# Altium schematic sheet ArbPwrBoost_P4.SchDoc: =ProjectTitle
size B; Engineer: Hab Collector; Organization: Altium Limited; Address1: 3621 Gin Way; Address2: Snellville, GA 30039; SheetNumber: 4; SheetTotal: 7
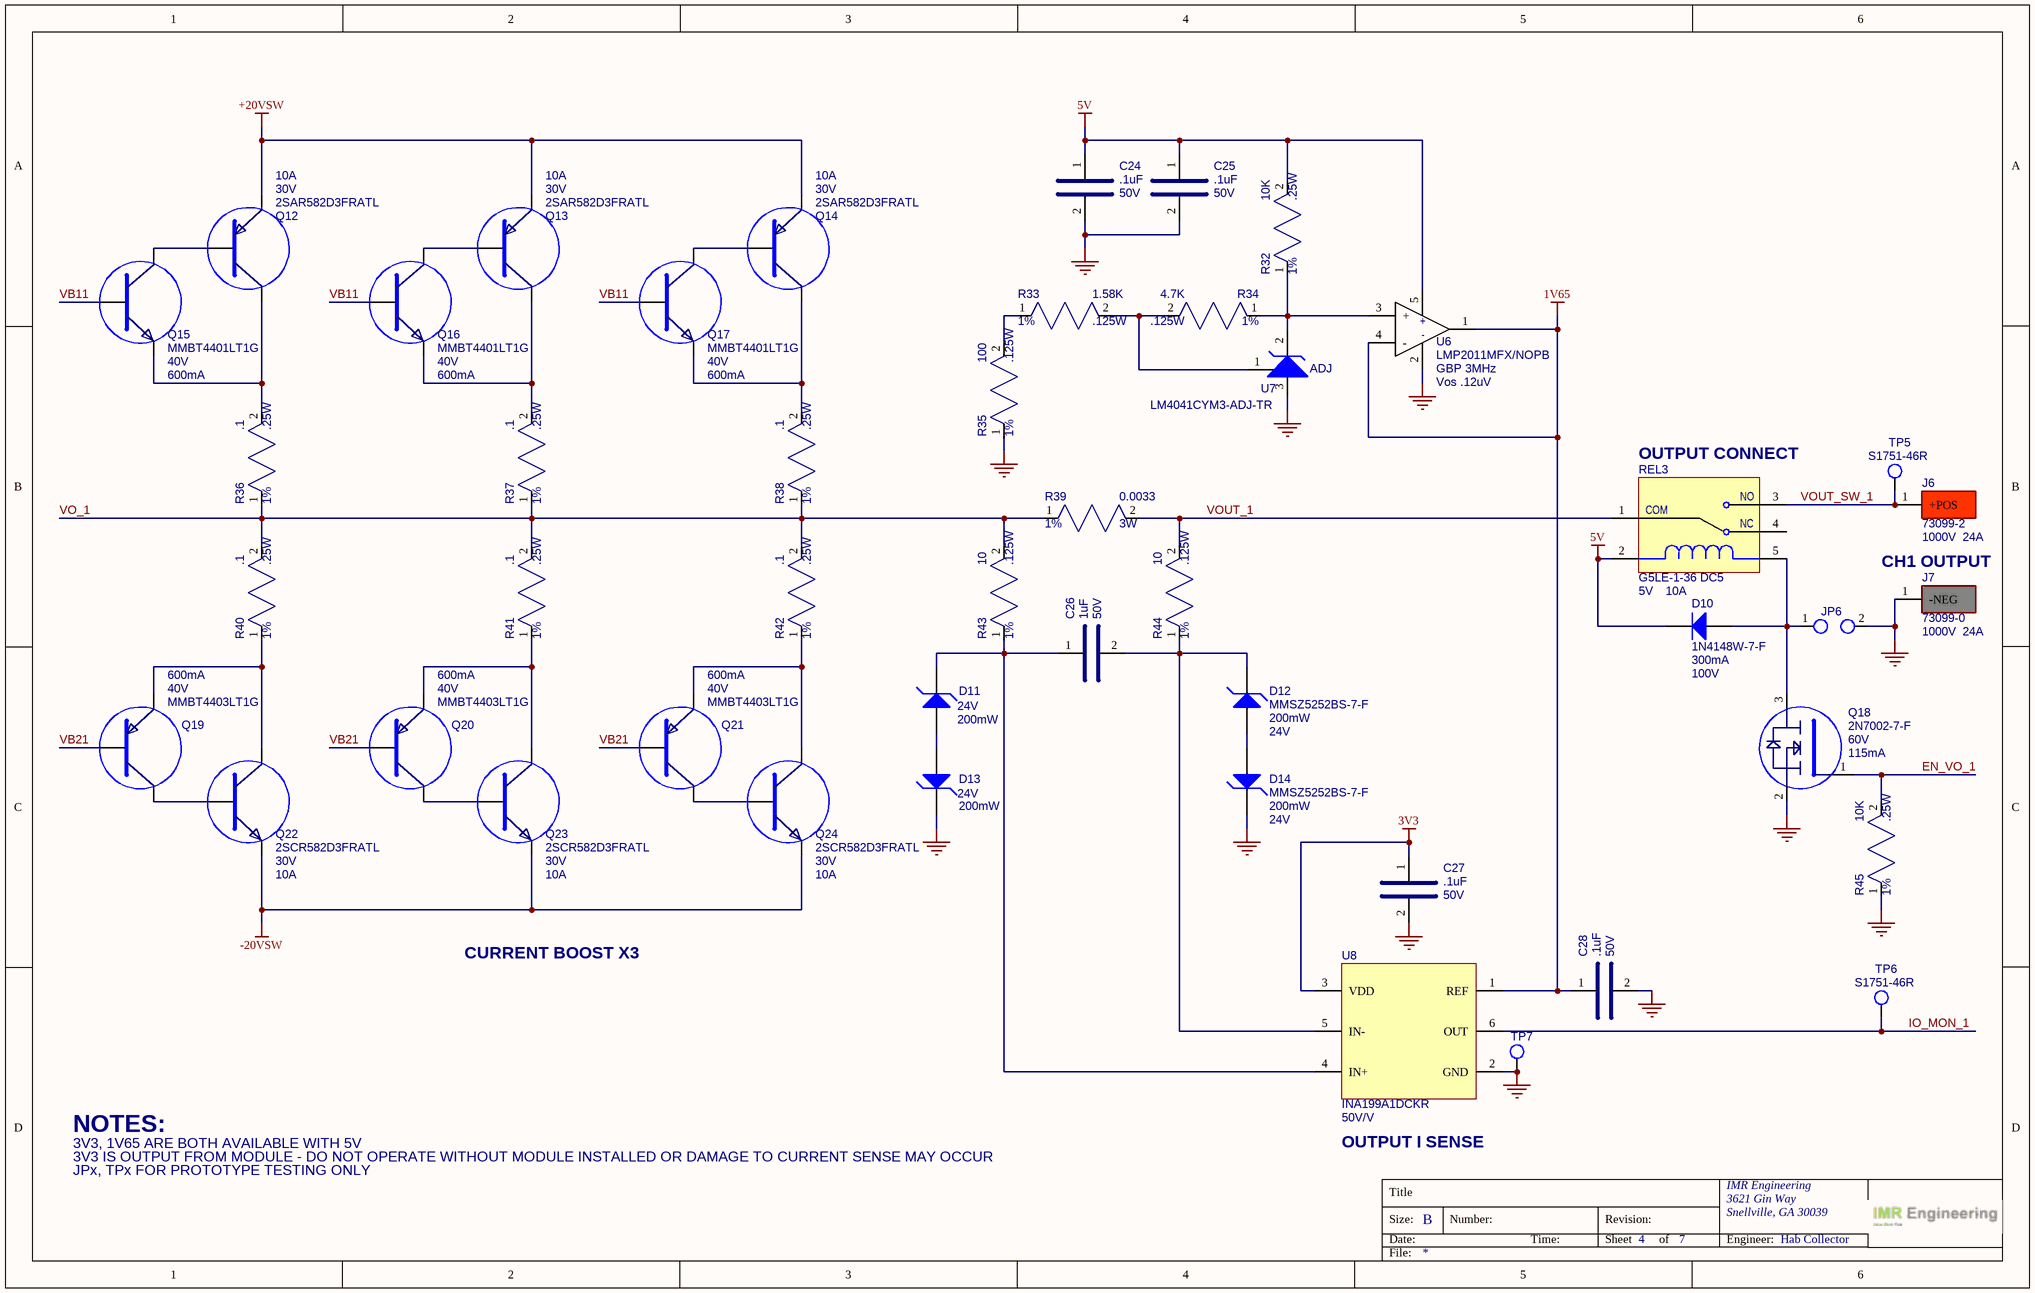
[diagram p0: ArbPwrBoost_P4.SchDoc]

## Parts
C24  value .1uF  Voltage: 50V  [CAP_0805]  (hidden comment: KGM21NR71H104KT)
C25  value .1uF  Voltage: 50V  [CAP_0805]  (hidden comment: KGM21NR71H104KT)
C26  value 1uF  Voltage: 50V  [CAP_0805]  (hidden comment: 08055C105K4T2A)
C27  value .1uF  Voltage: 50V  [CAP_0805]  (hidden comment: KGM21NR71H104KT)
C28  value .1uF  Voltage: 50V  [CAP_0805]  (hidden comment: KGM21NR71H104KT)
D10  value 100V  Current: 300mA  [SOD123]  (hidden comment: 1N4148W-7-F)
D11  value 24V  Power: 200mW  [SOD323]  (hidden comment: MMSZ5252BS-7-F)
D12  value 24V  Power: 200mW  [SOD323]  (hidden comment: MMSZ5252BS-7-F)
D13  value 24V  Power: 200mW  [SOD323]  (hidden comment: MMSZ5252BS-7-F)
D14  value 24V  Power: 200mW  [SOD323]  (hidden comment: MMSZ5252BS-7-F)
J6  value 1000V  Current: 24A  [Pomona_73099-2]  (hidden comment: 73099-2)
J7  value 1000V  Current: 24A  [Pomona_73099-0]  (hidden comment: 73099-0)
JP6  PREC002SFAN-RC  [HDR_1X2_100MILL]  (value not drawn)
Q12  value 30V  Current: 10A  [TO-252]  (hidden comment: 2SAR582D3FRATL)
Q13  value 30V  Current: 10A  [TO-252]  (hidden comment: 2SAR582D3FRATL)
Q14  value 30V  Current: 10A  [TO-252]  (hidden comment: 2SAR582D3FRATL)
Q15  value 40V  Current: 600mA  [SOT-23]  (hidden comment: MMBT4401LT1G)
Q16  value 40V  Current: 600mA  [SOT-23]  (hidden comment: MMBT4401LT1G)
Q17  value 40V  Current: 600mA  [SOT-23]  (hidden comment: MMBT4401LT1G)
Q18  value 60V  Current: 115mA  [SOT-23]  (hidden comment: 2N7002-7-F)
Q19  value 40V  Current: 600mA  [SOT-23]  (hidden comment: MMBT4403LT1G)
Q20  value 40V  Current: 600mA  [SOT-23]  (hidden comment: MMBT4403LT1G)
Q21  value 40V  Current: 600mA  [SOT-23]  (hidden comment: MMBT4403LT1G)
Q22  value 30V  Current: 10A  [TO-252]  (hidden comment: 2SCR582D3FRATL)
Q23  value 30V  Current: 10A  [TO-252]  (hidden comment: 2SCR582D3FRATL)
Q24  value 30V  Current: 10A  [TO-252]  (hidden comment: 2SCR582D3FRATL)
R32  value 10K  Power: .25W  Tolerance: 1%  [RES_0805]  (hidden comment: RC0805FR-7W10KL)
R33  value 1.58K  Power: .125W  Tolerance: 1%  [RES_0805]  (hidden comment: RC0805FR-071K58L)
R34  value 4.7K  Power: .125W  Tolerance: 1%  [RES_0805]  (hidden comment: RC0805FR-134K7L)
R35  value 100  Power: .125W  Tolerance: 1%  [RES_0805]  (hidden comment: RC0805FR-07100RL)
R36  value .1  Power: .25W  Tolerance: 1%  [RES_1206]  (hidden comment: 311-0.1LWCT-ND)
R37  value .1  Power: .25W  Tolerance: 1%  [RES_1206]  (hidden comment: 311-0.1LWCT-ND)
R38  value .1  Power: .25W  Tolerance: 1%  [RES_1206]  (hidden comment: 311-0.1LWCT-ND)
R39  value 0.0033  Tolerance: 1%  Power: 3W  [RES_2512]  (hidden comment: WSLP25123L300FEA)
R40  value .1  Power: .25W  Tolerance: 1%  [RES_1206]  (hidden comment: 311-0.1LWCT-ND)
R41  value .1  Power: .25W  Tolerance: 1%  [RES_1206]  (hidden comment: 311-0.1LWCT-ND)
R42  value .1  Power: .25W  Tolerance: 1%  [RES_1206]  (hidden comment: 311-0.1LWCT-ND)
R43  value 10  Power: .125W  Tolerance: 1%  [RES_0805]  (hidden comment: RC0805FR-1310RL)
R44  value 10  Power: .125W  Tolerance: 1%  [RES_0805]  (hidden comment: RC0805FR-1310RL)
R45  value 10K  Power: .25W  Tolerance: 1%  [RES_0805]  (hidden comment: RC0805FR-7W10KL)
REL3  value 5V  Current: 10A  [G5LE]  (hidden comment: G5LE-1-36 DC5)
TP5  S1751-46R  [HARWIN_S1751]
TP6  S1751-46R  [HARWIN_S1751]
TP7  (no value)  [TEST_POINT_20MIL_TH]  (no BOM)
U6  value GBP 3MHz  Vos: Vos .12uV  [SOT-23-5]  (hidden comment: LMP2011MFX/NOPB)
U7  value ADJ  [SOT-23]  (hidden comment: LM4041CYM3-ADJ-TR)
U8  value 50V/V  [SC-70-6]  (hidden comment: INA199A1DCKR)

## Nets
1V65: C28.1 U6.1 U6.4(-) U8.1(REF)
3V3: C27.1 U8.3(VDD)
5V: C24.1 C25.1 D10.2(K) R32.2 REL3.2 U6.5
+20VSW: Q12.2(E) Q13.2(E) Q14.2(E)
-20VSW: Q22.2(E) Q23.2(E) Q24.2(E)
GND: C24.2 C25.2 C27.2 C28.2 D13.2(K) D14.2(K) J7.1(-NEG) JP6.2 Q18.2(E) R35.1 R45.1 TP7.1 U6.2 U7.3(A) U8.2(GND)
EN_VO_1: Q18.1(B) R45.2
IO_MON_1: TP6.1 U8.6(OUT)
VB11: Q15.1(B) Q16.1(B) Q17.1(B)
VB21: Q19.1(B) Q20.1(B) Q21.1(B)
VO_1: R36.1 R37.1 R38.1 R39.1 R40.2 R41.2 R42.2 R43.2
VOUT_1: R39.2 R44.2 REL3.1(COM)
VOUT_SW_1: J6.1(+POS) REL3.3(NO) TP5.1
NetC26_1: C26.1 D11.2(K) R43.1 U8.4(IN+)
NetC26_2: C26.2 D12.2(K) R44.1 U8.5(IN-)
NetD10_1: D10.1(A) JP6.1 Q18.3(C) REL3.5
NetD11_1: D11.1(A) D13.1(A)
NetD12_1: D12.1(A) D14.1(A)
NetQ12_1: Q12.1(B) Q15.3(C)
NetQ12_3: Q12.3(C) Q15.2(E) R36.2
NetQ13_1: Q13.1(B) Q16.3(C)
NetQ13_3: Q13.3(C) Q16.2(E) R37.2
NetQ14_1: Q14.1(B) Q17.3(C)
NetQ14_3: Q14.3(C) Q17.2(E) R38.2
NetQ19_2: Q19.2(E) Q22.3(C) R40.1
NetQ19_3: Q19.3(C) Q22.1(B)
NetQ20_2: Q20.2(E) Q23.3(C) R41.1
NetQ20_3: Q20.3(C) Q23.1(B)
NetQ21_2: Q21.2(E) Q24.3(C) R42.1
NetQ21_3: Q21.3(C) Q24.1(B)
NetR32_1: R32.1 R34.1 U6.3(+) U7.2(K)
NetR33_1: R33.1 R35.2
NetR33_2: R33.2 R34.2 U7.1(FB)

Not connected (* = marked no-connect by the designer): REL3 4(NC)

## Notes on the sheet
- (near REL3) OUTPUT CONNECT
- (near J7) CH1 OUTPUT
- CURRENT BOOST X3
- NOTES:
- 3V3, 1V65 ARE BOTH AVAILABLE WITH 5V
- 3V3 IS OUTPUT FROM MODULE - DO NOT OPERATE WITHOUT MODULE INSTALLED OR DAMAGE TO CURRENT SENSE MAY OCCUR
- JPx, TPx FOR PROTOTYPE TESTING ONLY
- OUTPUT I SENSE
- Title
- Size:
- Date:
- B
- Number:
- Time:
- Revision:
- Sheet
- of
- IMR Engineering
- Engineer:
- File:

## Library data of the parts
C24 C25 C27 C28 = CAP_SMD_0.1UF_50V_0805: CAP CER 0.1UF 50V X7R 0805; MFG: KYOCERA AVX; Case/Package: 0805; MFG_PN: KGM21NR71H104KT; Supplier 1: DigiKey; Supplier Part Number 1: 478-KGM21NR71H104KTCT-ND; Unit Price: .1
C26 = CAP_SMD_1UF_50V_0805: CAP CER 1UF 50V X7R 0805; MFG: KYOCERA AVX; Case/Package: 0805; MFG_PN: 08055C105K4T2A; Supplier 1: DigiKey; Supplier Part Number 1: 478-KAM21KR71H105KUCT-ND; Unit Price: .27
D10 = DIODE_1N4148W-7-F: RELAY REED SPDT 250MA 5V; MFG: Diodes Inc; Case/Package: SOD-123; Supplier 1: DigiKey; Supplier Part Number 1: 1N4148W-FDICT-ND; Unit Price: .16; MFG_PN: 1N4148W-7-F
D11-D14 = DIODE_ZENER_MMSZ5252BS-7-F: DIODE ZENER 24V 200MW SOD323; MFG: Diodes Inc; Case/Package: SOD-123; Supplier 1: DigiKey; Supplier Part Number 1: MMSZ5252BS-FDICT-ND; Unit Price: .12; MFG_PN: MMSZ5252BS-7-F
J6 = CONN_PANOMA_73099-2: CONN 4mm Banana Socket Right Angle PCB RED; MFG: Pomona; Case/Package: 73099-2; Supplier 1: DigiKey; Supplier Part Number 1: 501-73099-2-ND; Unit Price: 10.39; MFG_PN: 73099-2
J7 = CONN_PANOMA_73099-0: CONN 4mm Banana Socket Right Angle PCB BLK; MFG: Pomona; Case/Package: 73099-0; Supplier 1: DigiKey; Supplier Part Number 1: 501-73099-0-ND; Unit Price: 10.39; MFG_PN: 73099-0
JP6 = CONN_JUMPER_2P_100MIL_VERT: CONN HEADER VERT 2POS 2.54MM; MFG: Sullins Connector Solutions; Case/Package: 2P_2.54MM; MFG_PN: PREC002SFAN-RC; Supplier 1: Digi-Key; Supplier Part Number 1: S1212EC-02-ND; Value: *; Unit Price: .07
Q12-Q14 = BJT_PNP_2SAR582D3FRATL: TRANS PNP 30V 5.7A TO-252; MFG: Rohm Semiconductor; Case/Package: TO-252; Supplier 1: DigiKey; Supplier Part Number 1: 846-2SAR582D3FRATLCT-ND; Unit Price: 1.59; MFG_PN: 2SAR582D3FRATL
Q15-Q17 = BJT_NPN_MMBT4401LT1G: TRANS NPN 40V 0.6A SOT23-3; MFG: On Semiconductor; Case/Package: SOT-23; Supplier 1: DigiKey; Supplier Part Number 1: MMBT4401LT1GOSCT-ND; Unit Price: .13; MFG_PN: MMBT4401LT1G
Q18 = MOSFET_NCH_2N7002-7-F: MOSFET N-CH 60V 115MA SOT23-3; MFG: Diodes Inc; Case/Package: SOT-23; Supplier 1: DigiKey; Supplier Part Number 1: 2N7002-FDICT-ND; Unit Price: .20; MFG_PN: 2N7002-7-F
Q19-Q21 = BJT_PNP_MMBT4403LT1G: TRANS PNP 40V 0.6A SOT23-3; MFG: On Semiconductor; Case/Package: SOT-23; Supplier 1: DigiKey; Supplier Part Number 1: MMBT4403LT1GOSCT-ND; Unit Price: .13; MFG_PN: MMBT4403LT1G
Q22-Q24 = BJT_NPN_2SCR582D3FRATL: TRANS NPN 30V 10A TO-252; MFG: Rohm Semiconductor; Case/Package: TO-252; Supplier 1: DigiKey; Supplier Part Number 1: 846-2SCR582D3FRATLCT-ND; Unit Price: 1.76; MFG_PN: 2SCR582D3FRATL
R32 R45 = RES_SMD_10K_0805_1/4W_1%: RES SMD 10K OHM 1% 1/4W 0805; MFG: Yageo; Case/Package: 0805; MFG_PN: RC0805FR-7W10KL; Supplier 1: DigiKey; Supplier Part Number 1: 13-RC0805FR-7W10KLCT-ND; Unit Price: .10
R33 = RES_SMD_1.58K_0805_1/8W_1%: RES SMD 1.58K OHM 1% 1/8W 0805; MFG: Yageo; Case/Package: 0805; MFG_PN: RC0805FR-071K58L; Supplier 1: DigiKey; Supplier Part Number 1: 311-1.58KCRCT-ND; Unit Price: .1
R34 = RES_SMD_4.7K_0805_1/8W_1%: RES SMD 4.7K OHM 1% 1/8W 0805; MFG: Yageo; Case/Package: 0805; MFG_PN: RC0805FR-134K7L; Supplier 1: DigiKey; Supplier Part Number 1: 13-RC0805FR-134K7LCT-ND; Unit Price: .1
R35 = RES_SMD_100_0805_1/8W_1%: RES SMD 100 OHM 1% 1/8W 0805; MFG: Yageo; Case/Package: 0805; MFG_PN: RC0805FR-07100RL; Supplier 1: DigiKey; Supplier Part Number 1: 311-100CRCT-ND; Unit Price: .1
R36-R38 R40-R42 = RES_SMD_0.1_1206_1/4W_1%: RES SMD 0.1 OHM 1% 1/4W 1206; MFG: Yageo; Case/Package: 1206; MFG_PN: 311-0.1LWCT-ND; Supplier 1: DigiKey; Supplier Part Number 1: 311-100KCRCT-ND; Unit Price: .45
R39 = RES_SMD_0.0033_2512_3W_1%: RES SMD 0.0033 OHM 1% 3W 2512; MFG: Vishay Dale; Case/Package: 2512; MFG_PN: WSLP25123L300FEA; Supplier 1: DigiKey; Supplier Part Number 1: 541-10151-1-ND; Unit Price: 1.23
R43 R44 = RES_SMD_10_0805_1/8W_1%: RES SMD 10 OHM 1% 1/8W 0805; MFG: Yageo; Case/Package: 0805; MFG_PN: RC0805FR-1310RL; Supplier 1: DigiKey; Supplier Part Number 1: 13-RC0805FR-1310RLCT-ND; Unit Price: .1
REL3 = RELAY_G5LE-1-36 DC5: RELAY GEN PURPOSE SPDT 10A 5V; MFG: Omron; Case/Package: G5LE; Supplier 1: DigiKey; Supplier Part Number 1: G5LE-1-36DC5-ND; Unit Price: 1.24; Supplier: DigiKey; Manufacturer: Omron; MFG_PN: G5LE-1-36 DC5
TP5 TP6 = CONN_TEST_POINT_S1751-46R: PCB TEST POINT CONNECT; MFG: Harwin Inc; Case/Package: S1751; MFG_PN: S1751-46R; Supplier 1: Digi-Key; Supplier Part Number 1: 952-1478-1-ND; Value: *; Unit Price: .28
TP7 = CONN_TEST_POINT_TH_PAD_20MIL: TEST POINT TH 20MIL HOLE
U6 = OPAMP_LMP2011MFX/NOPB: IC OPAMP GP 3MHZ .12uV CIRCUIT SOT23-5; MFG: Texas Instruments; Package/Case: SOT-23-5; Supplier 1: DigiKey; MFG_PN: LMP2011MFX/NOPB; Unit Price: 2.33; Supplier Part Number 1: LMP2011MFX/NOPBCT-ND
U7 = IC_LM4041CYM3-ADJ-TR: IC VREF SHUNT ADJ 0.5% SOT23-3; MFG: Microchip; Case/Package: SOT-23; Supplier 1: DigiKey; Supplier Part Number 1: 576-1049-1-ND; Unit Price: .39; MFG_PN: LM4041CYM3-ADJ-TR
U8 = IC_INA199A1DCKR: IC CURRENT SENSE 1.5% 50V/V SC70-6; MFG: Texas Instruments; Current: 2A; Case/Package: SC-70-6; Supplier 1: DigiKey; Supplier Part Number 1: 296-27329-1-ND; Unit Price: .45; MFG_PN: INA199A1DCKR